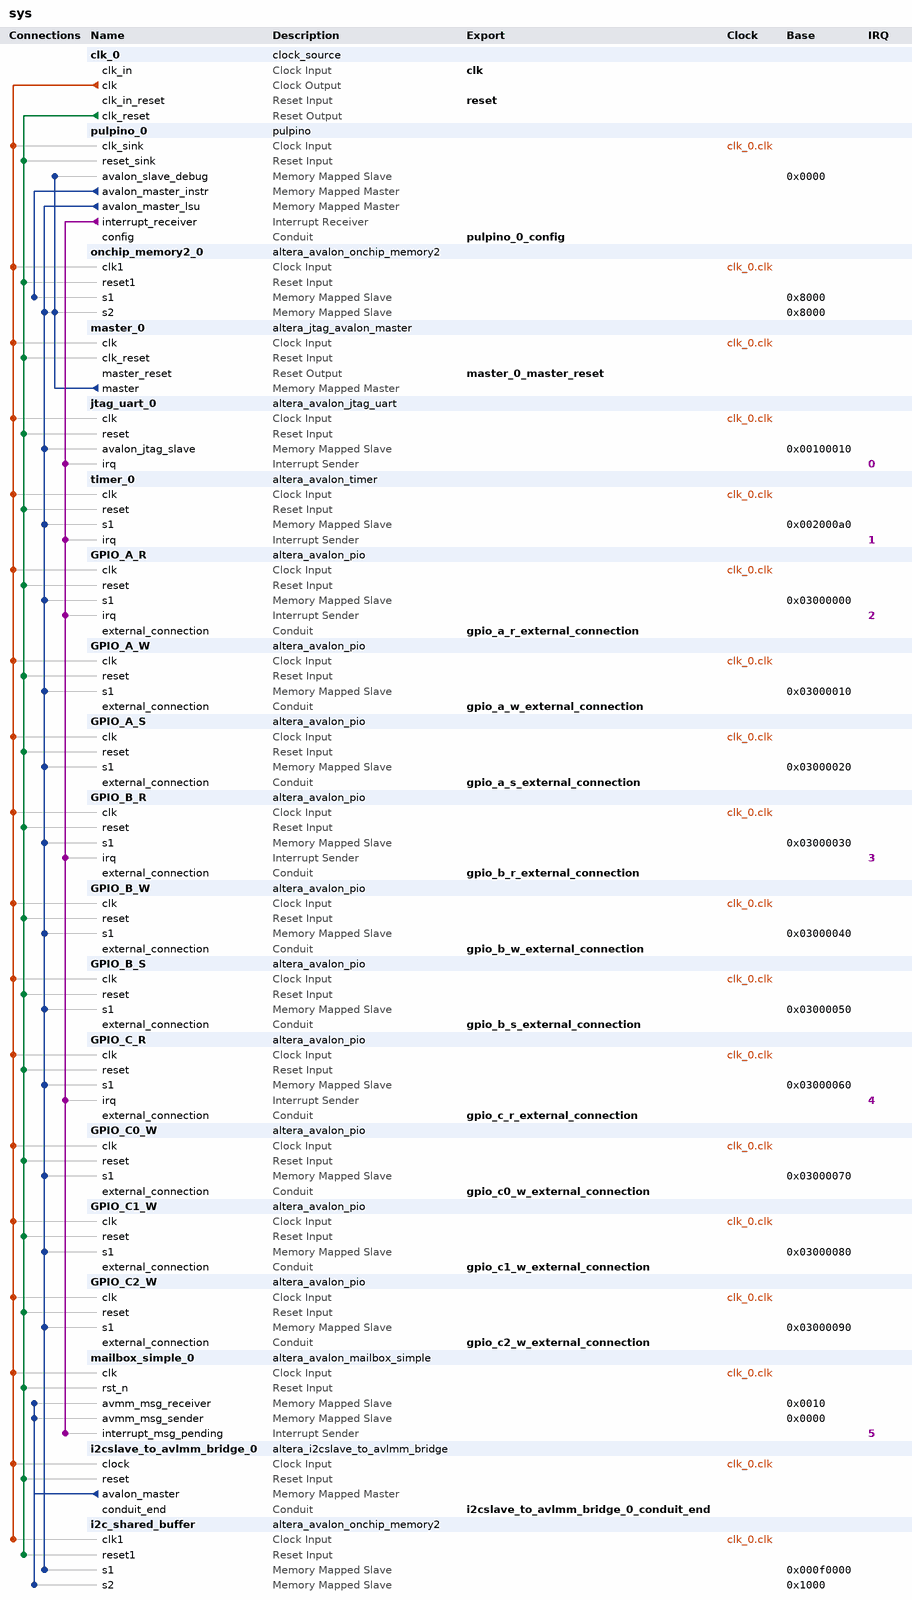
[diagram p0: system contents]
# Platform Designer (Qsys) system sys, Cyclone V 5CSEMA5F31C6
# Parameters at their usual value, and those the tool derives, are not listed.
package require -exact qsys 24.1
create_system sys
set_project_property DEVICE_FAMILY {Cyclone V}
set_project_property DEVICE 5CSEMA5F31C6

add_instance clk_0 clock_source 24.1
set_instance_parameter_value clk_0 clockFrequency 50000000

add_instance pulpino_0 pulpino 1.0
set_instance_parameter_value pulpino_0 AXI_ADDR_WIDTH 32
set_instance_parameter_value pulpino_0 AXI_DATA_WIDTH 32
set_instance_parameter_value pulpino_0 AXI_ID_MASTER_WIDTH 10
set_instance_parameter_value pulpino_0 AXI_ID_SLAVE_WIDTH 10
set_instance_parameter_value pulpino_0 AXI_USER_WIDTH 0
set_instance_parameter_value pulpino_0 RISCY_RV32F false
set_instance_parameter_value pulpino_0 USE_ZERO_RISCY true
set_instance_parameter_value pulpino_0 ZERO_RV32E false
set_instance_parameter_value pulpino_0 ZERO_RV32M true

add_instance onchip_memory2_0 altera_avalon_onchip_memory2 24.1
set_instance_parameter_value onchip_memory2_0 dataWidth 32
set_instance_parameter_value onchip_memory2_0 dualPort true
set_instance_parameter_value onchip_memory2_0 initMemContent true
set_instance_parameter_value onchip_memory2_0 memorySize 32768
set_instance_parameter_value onchip_memory2_0 singleClockOperation true

add_instance master_0 altera_jtag_avalon_master 24.1

add_instance jtag_uart_0 altera_avalon_jtag_uart 24.1
set_instance_parameter_value jtag_uart_0 simInteractiveOptions NO_INTERACTIVE_WINDOWS
set_instance_parameter_value jtag_uart_0 useRegistersForReadBuffer true
set_instance_parameter_value jtag_uart_0 useRegistersForWriteBuffer true

add_instance timer_0 altera_avalon_timer 24.1
set_instance_parameter_value timer_0 period 5000
set_instance_parameter_value timer_0 periodUnits CLOCKS

add_instance GPIO_A_R altera_avalon_pio 24.1
set_instance_parameter_value GPIO_A_R bitClearingEdgeCapReg true
set_instance_parameter_value GPIO_A_R captureEdge true
set_instance_parameter_value GPIO_A_R direction Input
set_instance_parameter_value GPIO_A_R generateIRQ true
set_instance_parameter_value GPIO_A_R irqType EDGE
set_instance_parameter_value GPIO_A_R width 32

add_instance GPIO_A_W altera_avalon_pio 24.1
set_instance_parameter_value GPIO_A_W direction Output
set_instance_parameter_value GPIO_A_W width 32

add_instance GPIO_A_S altera_avalon_pio 24.1
set_instance_parameter_value GPIO_A_S direction Output
set_instance_parameter_value GPIO_A_S width 32

add_instance GPIO_B_R altera_avalon_pio 24.1
set_instance_parameter_value GPIO_B_R bitClearingEdgeCapReg true
set_instance_parameter_value GPIO_B_R captureEdge true
set_instance_parameter_value GPIO_B_R direction Input
set_instance_parameter_value GPIO_B_R generateIRQ true
set_instance_parameter_value GPIO_B_R irqType EDGE
set_instance_parameter_value GPIO_B_R width 32

add_instance GPIO_B_W altera_avalon_pio 24.1
set_instance_parameter_value GPIO_B_W direction Output
set_instance_parameter_value GPIO_B_W width 32

add_instance GPIO_B_S altera_avalon_pio 24.1
set_instance_parameter_value GPIO_B_S direction Output
set_instance_parameter_value GPIO_B_S width 32

add_instance GPIO_C_R altera_avalon_pio 24.1
set_instance_parameter_value GPIO_C_R bitClearingEdgeCapReg true
set_instance_parameter_value GPIO_C_R captureEdge true
set_instance_parameter_value GPIO_C_R direction Input
set_instance_parameter_value GPIO_C_R generateIRQ true
set_instance_parameter_value GPIO_C_R irqType EDGE
set_instance_parameter_value GPIO_C_R width 32

add_instance GPIO_C0_W altera_avalon_pio 24.1
set_instance_parameter_value GPIO_C0_W direction Output
set_instance_parameter_value GPIO_C0_W width 32

add_instance GPIO_C1_W altera_avalon_pio 24.1
set_instance_parameter_value GPIO_C1_W direction Output
set_instance_parameter_value GPIO_C1_W width 32

add_instance GPIO_C2_W altera_avalon_pio 24.1
set_instance_parameter_value GPIO_C2_W direction Output
set_instance_parameter_value GPIO_C2_W width 32

add_instance mailbox_simple_0 altera_avalon_mailbox_simple 24.1
set_instance_parameter_value mailbox_simple_0 AWIDTH 2
set_instance_parameter_value mailbox_simple_0 DWIDTH 32
set_instance_parameter_value mailbox_simple_0 MSG_ARRIVAL_NOTIFY 1
set_instance_parameter_value mailbox_simple_0 MSG_SPACE_NOTIFY 0

add_instance i2cslave_to_avlmm_bridge_0 altera_i2cslave_to_avlmm_bridge 24.1
set_instance_parameter_value i2cslave_to_avlmm_bridge_0 ADDRESS_STEALING 0
set_instance_parameter_value i2cslave_to_avlmm_bridge_0 BYTE_ADDRESSING 2
set_instance_parameter_value i2cslave_to_avlmm_bridge_0 I2C_SLAVE_ADDRESS 85
set_instance_parameter_value i2cslave_to_avlmm_bridge_0 READ_ONLY 0

add_instance i2c_shared_buffer altera_avalon_onchip_memory2 24.1
set_instance_parameter_value i2c_shared_buffer dataWidth 32
set_instance_parameter_value i2c_shared_buffer dualPort true
set_instance_parameter_value i2c_shared_buffer initMemContent true
set_instance_parameter_value i2c_shared_buffer initializationFileName onchip_mem.hex
set_instance_parameter_value i2c_shared_buffer memorySize 256
set_instance_parameter_value i2c_shared_buffer singleClockOperation true

# connections
add_connection clk_0.clk GPIO_A_R.clk clock
add_connection clk_0.clk GPIO_A_S.clk clock
add_connection clk_0.clk GPIO_A_W.clk clock
add_connection clk_0.clk GPIO_B_R.clk clock
add_connection clk_0.clk GPIO_B_S.clk clock
add_connection clk_0.clk GPIO_B_W.clk clock
add_connection clk_0.clk GPIO_C0_W.clk clock
add_connection clk_0.clk GPIO_C1_W.clk clock
add_connection clk_0.clk GPIO_C2_W.clk clock
add_connection clk_0.clk GPIO_C_R.clk clock
add_connection clk_0.clk i2c_shared_buffer.clk1 clock
add_connection clk_0.clk i2cslave_to_avlmm_bridge_0.clock clock
add_connection clk_0.clk jtag_uart_0.clk clock
add_connection clk_0.clk mailbox_simple_0.clk clock
add_connection clk_0.clk master_0.clk clock
add_connection clk_0.clk onchip_memory2_0.clk1 clock
add_connection clk_0.clk pulpino_0.clk_sink clock
add_connection clk_0.clk timer_0.clk clock
add_connection clk_0.clk_reset GPIO_A_R.reset reset
add_connection clk_0.clk_reset GPIO_A_S.reset reset
add_connection clk_0.clk_reset GPIO_A_W.reset reset
add_connection clk_0.clk_reset GPIO_B_R.reset reset
add_connection clk_0.clk_reset GPIO_B_S.reset reset
add_connection clk_0.clk_reset GPIO_B_W.reset reset
add_connection clk_0.clk_reset GPIO_C0_W.reset reset
add_connection clk_0.clk_reset GPIO_C1_W.reset reset
add_connection clk_0.clk_reset GPIO_C2_W.reset reset
add_connection clk_0.clk_reset GPIO_C_R.reset reset
add_connection clk_0.clk_reset i2c_shared_buffer.reset1 reset
add_connection clk_0.clk_reset i2cslave_to_avlmm_bridge_0.reset reset
add_connection clk_0.clk_reset jtag_uart_0.reset reset
add_connection clk_0.clk_reset mailbox_simple_0.rst_n reset
add_connection clk_0.clk_reset master_0.clk_reset reset
add_connection clk_0.clk_reset onchip_memory2_0.reset1 reset
add_connection clk_0.clk_reset pulpino_0.reset_sink reset
add_connection clk_0.clk_reset timer_0.reset reset
add_connection i2cslave_to_avlmm_bridge_0.avalon_master i2c_shared_buffer.s2 avalon
set_connection_parameter_value i2cslave_to_avlmm_bridge_0.avalon_master/i2c_shared_buffer.s2 baseAddress 0x1000
add_connection i2cslave_to_avlmm_bridge_0.avalon_master mailbox_simple_0.avmm_msg_receiver avalon
set_connection_parameter_value i2cslave_to_avlmm_bridge_0.avalon_master/mailbox_simple_0.avmm_msg_receiver baseAddress 0x0010
add_connection i2cslave_to_avlmm_bridge_0.avalon_master mailbox_simple_0.avmm_msg_sender avalon
set_connection_parameter_value i2cslave_to_avlmm_bridge_0.avalon_master/mailbox_simple_0.avmm_msg_sender baseAddress 0x0000
add_connection master_0.master onchip_memory2_0.s2 avalon
set_connection_parameter_value master_0.master/onchip_memory2_0.s2 baseAddress 0x8000
add_connection master_0.master pulpino_0.avalon_slave_debug avalon
set_connection_parameter_value master_0.master/pulpino_0.avalon_slave_debug baseAddress 0x0000
add_connection pulpino_0.avalon_master_instr onchip_memory2_0.s1 avalon
set_connection_parameter_value pulpino_0.avalon_master_instr/onchip_memory2_0.s1 baseAddress 0x8000
add_connection pulpino_0.avalon_master_lsu GPIO_A_R.s1 avalon
set_connection_parameter_value pulpino_0.avalon_master_lsu/GPIO_A_R.s1 baseAddress 0x03000000
add_connection pulpino_0.avalon_master_lsu GPIO_A_S.s1 avalon
set_connection_parameter_value pulpino_0.avalon_master_lsu/GPIO_A_S.s1 baseAddress 0x03000020
add_connection pulpino_0.avalon_master_lsu GPIO_A_W.s1 avalon
set_connection_parameter_value pulpino_0.avalon_master_lsu/GPIO_A_W.s1 baseAddress 0x03000010
add_connection pulpino_0.avalon_master_lsu GPIO_B_R.s1 avalon
set_connection_parameter_value pulpino_0.avalon_master_lsu/GPIO_B_R.s1 baseAddress 0x03000030
add_connection pulpino_0.avalon_master_lsu GPIO_B_S.s1 avalon
set_connection_parameter_value pulpino_0.avalon_master_lsu/GPIO_B_S.s1 baseAddress 0x03000050
add_connection pulpino_0.avalon_master_lsu GPIO_B_W.s1 avalon
set_connection_parameter_value pulpino_0.avalon_master_lsu/GPIO_B_W.s1 baseAddress 0x03000040
add_connection pulpino_0.avalon_master_lsu GPIO_C0_W.s1 avalon
set_connection_parameter_value pulpino_0.avalon_master_lsu/GPIO_C0_W.s1 baseAddress 0x03000070
add_connection pulpino_0.avalon_master_lsu GPIO_C1_W.s1 avalon
set_connection_parameter_value pulpino_0.avalon_master_lsu/GPIO_C1_W.s1 baseAddress 0x03000080
add_connection pulpino_0.avalon_master_lsu GPIO_C2_W.s1 avalon
set_connection_parameter_value pulpino_0.avalon_master_lsu/GPIO_C2_W.s1 baseAddress 0x03000090
add_connection pulpino_0.avalon_master_lsu GPIO_C_R.s1 avalon
set_connection_parameter_value pulpino_0.avalon_master_lsu/GPIO_C_R.s1 baseAddress 0x03000060
add_connection pulpino_0.avalon_master_lsu i2c_shared_buffer.s1 avalon
set_connection_parameter_value pulpino_0.avalon_master_lsu/i2c_shared_buffer.s1 baseAddress 0x000f0000
add_connection pulpino_0.avalon_master_lsu jtag_uart_0.avalon_jtag_slave avalon
set_connection_parameter_value pulpino_0.avalon_master_lsu/jtag_uart_0.avalon_jtag_slave baseAddress 0x00100010
add_connection pulpino_0.avalon_master_lsu onchip_memory2_0.s2 avalon
set_connection_parameter_value pulpino_0.avalon_master_lsu/onchip_memory2_0.s2 baseAddress 0x8000
add_connection pulpino_0.avalon_master_lsu timer_0.s1 avalon
set_connection_parameter_value pulpino_0.avalon_master_lsu/timer_0.s1 baseAddress 0x002000a0
add_connection pulpino_0.interrupt_receiver GPIO_A_R.irq interrupt
set_connection_parameter_value pulpino_0.interrupt_receiver/GPIO_A_R.irq irqNumber 2
add_connection pulpino_0.interrupt_receiver GPIO_B_R.irq interrupt
set_connection_parameter_value pulpino_0.interrupt_receiver/GPIO_B_R.irq irqNumber 3
add_connection pulpino_0.interrupt_receiver GPIO_C_R.irq interrupt
set_connection_parameter_value pulpino_0.interrupt_receiver/GPIO_C_R.irq irqNumber 4
add_connection pulpino_0.interrupt_receiver jtag_uart_0.irq interrupt
set_connection_parameter_value pulpino_0.interrupt_receiver/jtag_uart_0.irq irqNumber 0
add_connection pulpino_0.interrupt_receiver mailbox_simple_0.interrupt_msg_pending interrupt
set_connection_parameter_value pulpino_0.interrupt_receiver/mailbox_simple_0.interrupt_msg_pending irqNumber 5
add_connection pulpino_0.interrupt_receiver timer_0.irq interrupt
set_connection_parameter_value pulpino_0.interrupt_receiver/timer_0.irq irqNumber 1

# exported interfaces
add_interface clk clock sink
set_interface_property clk EXPORT_OF clk_0.clk_in
add_interface gpio_a_r_external_connection conduit end
set_interface_property gpio_a_r_external_connection EXPORT_OF GPIO_A_R.external_connection
add_interface gpio_a_s_external_connection conduit end
set_interface_property gpio_a_s_external_connection EXPORT_OF GPIO_A_S.external_connection
add_interface gpio_a_w_external_connection conduit end
set_interface_property gpio_a_w_external_connection EXPORT_OF GPIO_A_W.external_connection
add_interface gpio_b_r_external_connection conduit end
set_interface_property gpio_b_r_external_connection EXPORT_OF GPIO_B_R.external_connection
add_interface gpio_b_s_external_connection conduit end
set_interface_property gpio_b_s_external_connection EXPORT_OF GPIO_B_S.external_connection
add_interface gpio_b_w_external_connection conduit end
set_interface_property gpio_b_w_external_connection EXPORT_OF GPIO_B_W.external_connection
add_interface gpio_c0_w_external_connection conduit end
set_interface_property gpio_c0_w_external_connection EXPORT_OF GPIO_C0_W.external_connection
add_interface gpio_c1_w_external_connection conduit end
set_interface_property gpio_c1_w_external_connection EXPORT_OF GPIO_C1_W.external_connection
add_interface gpio_c2_w_external_connection conduit end
set_interface_property gpio_c2_w_external_connection EXPORT_OF GPIO_C2_W.external_connection
add_interface gpio_c_r_external_connection conduit end
set_interface_property gpio_c_r_external_connection EXPORT_OF GPIO_C_R.external_connection
add_interface i2cslave_to_avlmm_bridge_0_conduit_end conduit end
set_interface_property i2cslave_to_avlmm_bridge_0_conduit_end EXPORT_OF i2cslave_to_avlmm_bridge_0.conduit_end
add_interface master_0_master_reset reset source
set_interface_property master_0_master_reset EXPORT_OF master_0.master_reset
add_interface pulpino_0_config conduit end
set_interface_property pulpino_0_config EXPORT_OF pulpino_0.config
add_interface reset reset sink
set_interface_property reset EXPORT_OF clk_0.clk_in_reset

set_interconnect_requirement {$system} qsys_mm.clockCrossingAdapter HANDSHAKE
set_interconnect_requirement {$system} qsys_mm.enableEccProtection FALSE
set_interconnect_requirement {$system} qsys_mm.insertDefaultSlave FALSE
set_interconnect_requirement {$system} qsys_mm.maxAdditionalLatency 1

save_system sys.qsys
